# EAGLE design yuh (EAGLE 9.6.2)
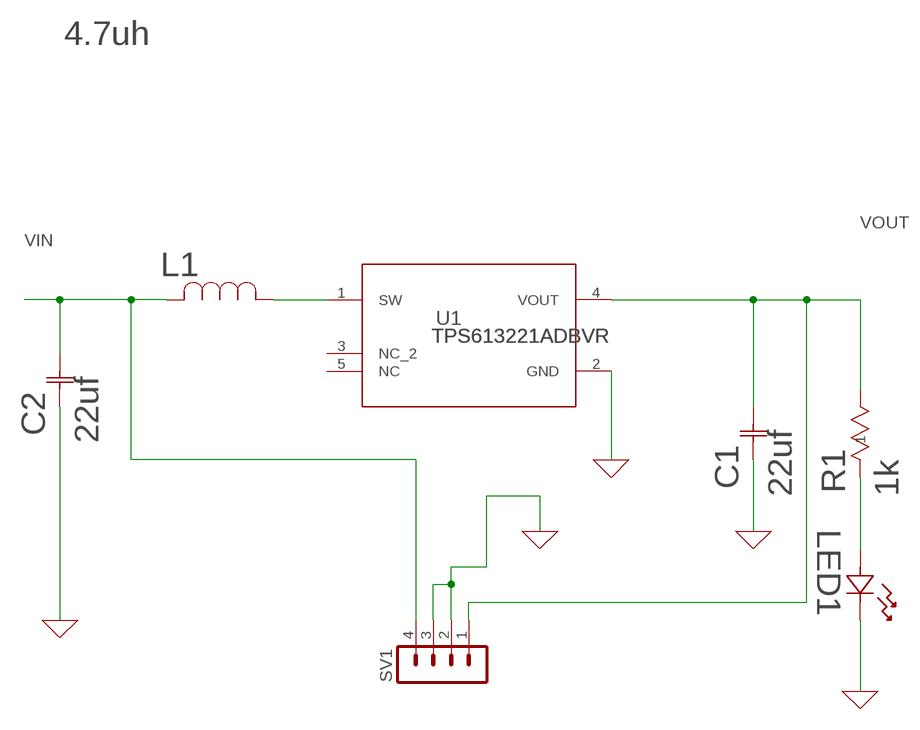
[diagram p0: schematic, sheet 1]

## Parts
C1  22uf  CL21A226MQQNNNE  [CAP_CL21_SAM]
C2  22uf  CL21A226MQQNNNE  [CAP_CL21_SAM]
L1  4.7uh  LQM18PN4R7MFRL  [IND_LQM18PXXXXFRX_MUR]
LED1  150080BS75000  [LED_BS75000_WRE]
R1  1k  RC1206FR-071KL  [RES_RC1206_YAG]
SV1  MA04-1  [MA04-1]
U1  TPS613221ADBVR  [DBV0005A_N]

## Nets
0: C1.1 C2.1 LED1.1 SV1.2 SV1.3 U1.2(GND) ; supply symbol labelled GND
N$2: L1.1 U1.1(SW)
N$6: LED1.2 R1.1
VIN: C2.2 L1.2 SV1.4
VOUT: C1.2 R1.2 SV1.1 U1.4(VOUT)
Unconnected: U1.3(NC_2) U1.5(NC)

## Library data of the parts
C1 C2 = lib:CL21A226MQQNNNE; COPYRIGHT: Copyright (C) 2024 Ultra Librarian. All rights reserved.; MANUFACTURER_PART_NUMBER: CL21A226MQQNNNE; MFR_NAME: Samsung
L1 = lib:LQM18PN4R7MFRL; COPYRIGHT: Copyright (C) 2024 Ultra Librarian. All rights reserved.; MANUFACTURER_PART_NUMBER: LQM18PN4R7MFRL; MFR_NAME: Murata
LED1 = lib:150080BS75000; COPYRIGHT: Copyright (C) 2024 Ultra Librarian. All rights reserved.; MANUFACTURER_PART_NUMBER: 150080BS75000; MFR_NAME: Wurth Electronics
R1 = lib:RC1206FR-071KL; COPYRIGHT: Copyright (C) 2024 Ultra Librarian. All rights reserved.; MANUFACTURER_PART_NUMBER: RC1206FR-071KL; MFR_NAME: Yageo
SV1 = con-lstb:MA04-1: PIN HEADER; OC_FARNELL: unknown; OC_NEWARK: unknown
U1 = lib:TPS613221ADBVR; COPYRIGHT: Copyright (C) 2024 Ultra Librarian. All rights reserved.; MANUFACTURER_PART_NUMBER: TPS613221ADBVR; MFR_NAME: Texas Instruments; REFDES: RefDes; TYPE: TYPE

## Board
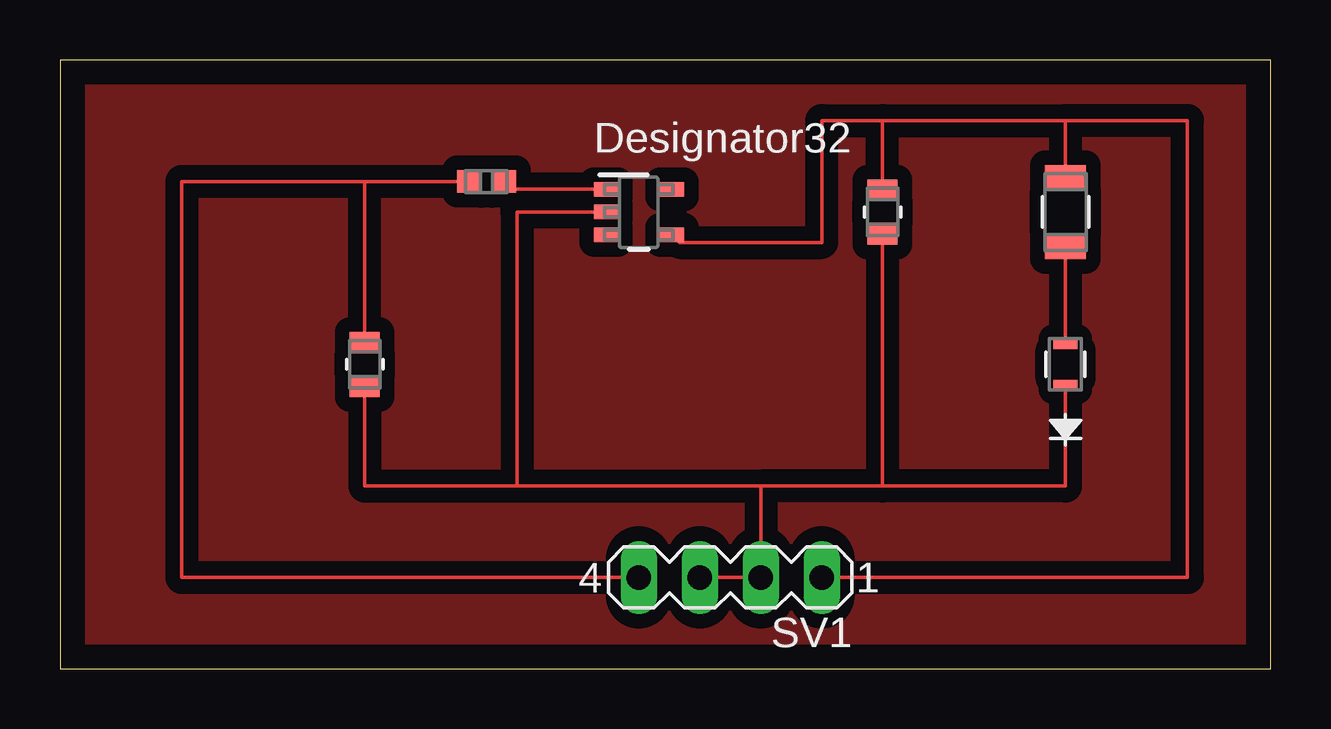
[diagram p1: board, top side]

Size 50.47 x 25.39 mm. Coordinates in mm from the lower left corner, seen from the top.
Outline: 0,0 50.47,0 50.47,25.39 0,25.39 0,0
Copper layers (1*16): Top 0.035mm / dielectric 1.5mm / Bottom 0.035mm
Design rules "default": minimum track width 6mil, minimum drill 0.35mm, track to track 6mil, track to pad 6mil, pad to pad 6mil, via to via 6mil, smd to smd 6mil, copper to edge 40mil, drill to drill 6mil, minimum pad ring 10mil, minimum via ring 8mil, stop-mask expansion 4mil, vias tented up to drill 0mil, thermal gap 10mil

### Footprints (pad centres in the part's own frame; a part is rotated, then mirrored left to right if it is on the bottom)
CAP_CL21_SAM = smd 0.856 x 1.25: 1 -0.928,0; 2 0.928,0
IND_LQM18PXXXXFRX_MUR = smd 0.965 x 0.94: 1 -0.749,0; 2 0.749,0
LED_BS75000_WRE = smd 0.406 x 0.991: 1 -0.851,0; 2 0.851,0
RES_RC1206_YAG = smd 1.016 x 1.702: 1 -1.448,0; 2 1.448,0
MA04-1 = drill 1.016 long: 1 -3.81,0; 2 -1.27,0; 3 1.27,0; 4 3.81,0
DBV0005A_N = smd 1 x 0.6: 1 -1.375,0.95; 2 -1.375,0; 3 -1.375,-0.95; 4 1.375,-0.95; 5 1.375,0.95

### Placement (x,y rotation side)
C1  34.29,19.05 90 top
C2  12.7,12.7 90 top
L1  17.78,20.32 180 top
LED1  41.91,12.7 90 top
R1  41.91,19.05 90 top
SV1  27.94,3.81 180 top
U1  24.13,19.05 0 top

### Tracks (layer width: path | path; a pad name or v marks a point on that pad's centre or on a via)
0
  Top 0.152: SV1.3 SV1.2 29.21,7.62 | C2.1 12.7,7.62 19.05,7.62 | 19.05,7.62 29.21,7.62 | U1.2 19.05,19.05 19.05,7.62 | C1.1 34.29,7.62 | 34.29,7.62 29.21,7.62 | LED1.1 41.91,7.62 34.29,7.62
GND
  pour Top (isolate 0.61): 0,25.4 0,0 50.8,0 50.8,25.4
N$2
  Top 0.152: U1.1 18.85,20 L1.1
N$6
  Top 0.152: R1.1 LED1.2
VIN
  Top 0.152: L1.2 12.7,20.32 | 12.7,20.32 5.08,20.32 5.08,3.81 SV1.4 | C2.2 12.7,20.32
VOUT
  Top 0.152: C1.2 34.29,22.86 | 34.29,22.86 41.91,22.86 | 41.91,22.86 R1.2 | 41.91,22.86 46.99,22.86 46.99,3.81 SV1.1 | U1.4 25.82,17.78 31.75,17.78 31.75,22.86 34.29,22.86